# EAGLE design hot_swap (EAGLE 7.1.0)
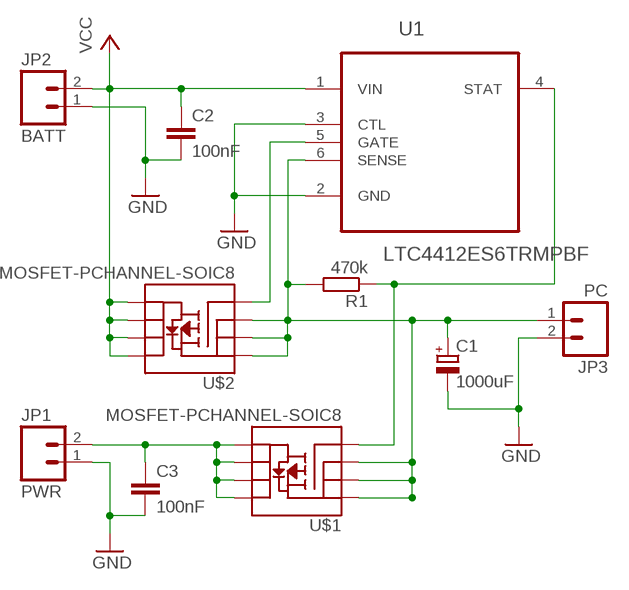
[diagram p0: schematic, sheet 1]

## Parts
C1  1000uF  CPOL-EUE3.5-8  [E3,5-8]
C2  100nF  C-EUC0603K  [C0603K]
C3  100nF  C-EUC0603K  [C0603K]
JP1  PWR  M023.5MM  [SCREWTERMINAL-3.5MM-2]
JP2  BATT  M023.5MM  [SCREWTERMINAL-3.5MM-2]
JP3  PC  M023.5MM  [SCREWTERMINAL-3.5MM-2]
R1  470k  R-EU_R0603  [R0603]
U1  LTC4412ES6TRMPBF  [SOT95P280X100-6N]
U$1  MOSFET-PCHANNEL-SOIC8  MOSFET-PCHANNEL-SOIC8SOIC8  [SO08]
U$2  MOSFET-PCHANNEL-SOIC8  MOSFET-PCHANNEL-SOIC8SOIC8  [SO08]

## Nets
GND: C1.- C2.2 C3.2 JP1.1 JP2.1 JP3.2 U1.2(GND) U1.3(CTL)
N$1: C1.+ JP3.1 R1.2 U1.6(SENSE) U$1.1(S) U$1.2(S) U$1.3(S) U$2.1(S) U$2.2(S) U$2.3(S)
N$3: U1.5(GATE) U$2.4(G)
N$4: R1.1 U1.4(STAT) U$1.4(G)
VCC: C2.1 JP2.2 U1.1(VIN) U$2.5(D) U$2.6(D) U$2.7(D) U$2.8(D)
VCC2: C3.1 JP1.2 U$1.5(D) U$1.6(D) U$1.7(D) U$1.8(D)

## Library data of the parts
C1 = rcl:CPOL-EU: POLARIZED CAPACITOR, European symbol
C2 C3 = rcl:C-EU: CAPACITOR, European symbol
JP1-JP3 = SparkFun:M02: Header 2 Standard 2-pin 0.1" header. Use with straight break away headers (SKU : PRT-00116), right angle break away headers (PRT-00553), swiss pins (PRT-00743), machine pins (PRT-00117), and female headers (PRT-00115). Molex polarized connector foot print use with SKU : PRT-08233 with associated crimp pins and housings.
R1 = rcl:R-EU_: RESISTOR, European symbol
U1 = ltc4412:LTC4412ES6TRMPBF: Low Loss PowerPath Controller; MPN: LTC4412ES6#TRMPBF; OC_FARNELL: 1663917; OC_NEWARK: 19P0727; PACKAGE: TSOT-23-6; SUPPLIER: Linear Technology
U$1 U$2 = SparkFun:MOSFET-PCHANNEL-SOIC8

## Net classes
0 default: clearance 0.205 mm

## Board
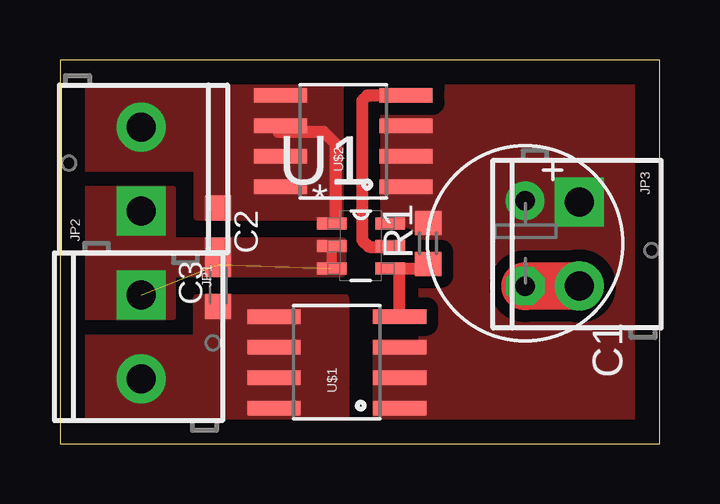
[diagram p1: board, top side]
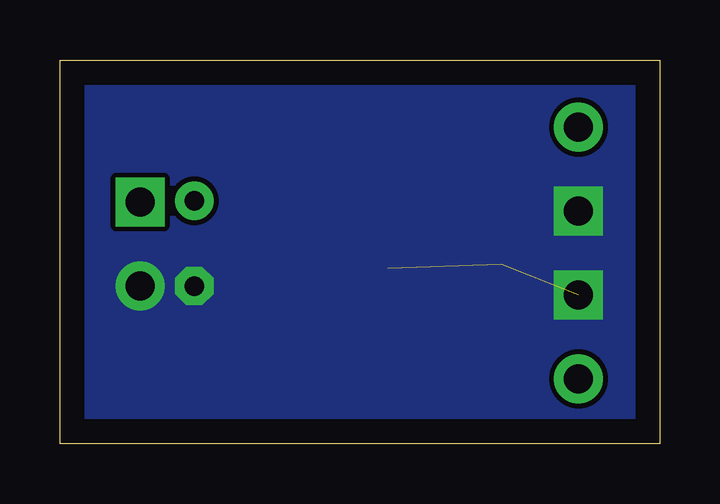
[diagram p2: board, bottom side, seen from below]

Size 25 x 16 mm. Coordinates in mm from the lower left corner, seen from the top.
Outline: 0,0 25,0 25,16 0,16 0,0
Copper layers (1*16): Top 0.035mm / dielectric 1.5mm / Bottom 0.035mm
Design rules "default": minimum track width 10mil, minimum drill 24mil, track to track 8mil, track to pad 8mil, pad to pad 8mil, via to via 8mil, smd to smd 8mil, copper to edge 40mil, drill to drill 8mil, minimum pad ring 10mil, minimum via ring 8mil, stop-mask expansion 4mil, vias tented up to drill 0mil, thermal gap 10mil

### Footprints (pad centres in the part's own frame; a part is rotated, then mirrored left to right if it is on the bottom)
E3,5-8 = drill 0.813 pad 1.6: + -1.778,0 | drill 0.813 pad 1.6 octagon: - 1.778,0
C0603K = smd 1.05 x 1.08: 1 -0.875,0; 2 0.875,0
SCREWTERMINAL-3.5MM-2 = drill 1.2 pad 2.032 square: 1 0,0 | drill 1.2 pad 2.032: 2 3.5,0
R0603 = smd 1 x 1.1: 1 -0.85,0; 2 0.85,0
SOT95P280X100-6N = smd 1.219 x 0.508: 1 -1.219,0.94; 2 -1.219,0; 3 -1.219,-0.94; 4 1.219,-0.94; 5 1.219,0; 6 1.219,0.94
SO08 = smd 0.61 x 2.21: 1 -1.905,-2.616; 2 -0.635,-2.616; 3 0.635,-2.616; 4 1.905,-2.616; 5 1.905,2.616; 6 0.635,2.616; 7 -0.635,2.616; 8 -1.905,2.616

### Placement (x,y rotation side)
C1  19.4,8.35 270 top
C2  6.6,8.95 270 top
C3  6.6,6.6 90 top
JP1  3.38,6.2 270 top
JP2  3.38,9.7 90 top
JP3  21.66,10.07 270 top
R1  15.35,8.35 90 top
U1  12.55,8.24 0 top
U$1  11.55,3.39 90 top
U$2  11.82,12.61 90 top

### Tracks (layer width: path | path; a pad name or v marks a point on that pad's centre or on a via)
GND  (2 unrouted)
  Top 0.406: U1.2 U1.3
  Top 2: C1.- 21.65,6.6
  pour Bottom (isolate 0.2, no thermals): 0,16 25,16 25,0 0,0
  pour Top (isolate 0.2, no thermals): 0,10.6 0,5.3 4.7,5.3 4.7,7.1 11.8,7.1 11.8,8.45 4.7,8.45 4.7,10.6
N$1
  Top 0.406: 15.03,9.18 R1.2
  pour Top (isolate 0.5, no thermals): 13.4,16.05 25,16 25,0 13.2,0 13.2,4.2 15.1,4.2 15.1,8.95 13.45,9
N$3
  Top 0.5: U1.5 13.63,8.2 12.9,8.2 12.6,8.5 12.6,14.3 12.81,14.52 U$2.4
N$4
  Top 0.5: U1.4 14.17,7.3 | R1.1 15.15,7.3 14.9,7.3 14.17,7.3 | U$1.4 14.17,7.3
VCC
  Top 0.5: U1.1 11.42,9.28 11.5,9.4 11.5,12.5 11,13 9.11,13
  pour Top (isolate 0.3, no thermals): 0,16 0,11.5 5.7,11.5 5.7,9.45 11.7,9.45 11.7,16
VCC2
  pour Top (isolate 0.3, no thermals): 0,0 0,4.4 5.7,4.4 5.7,6.1 11.9,6.1 11.9,0